# EAGLE design pms7003-adapter (EAGLE 9.6.2)
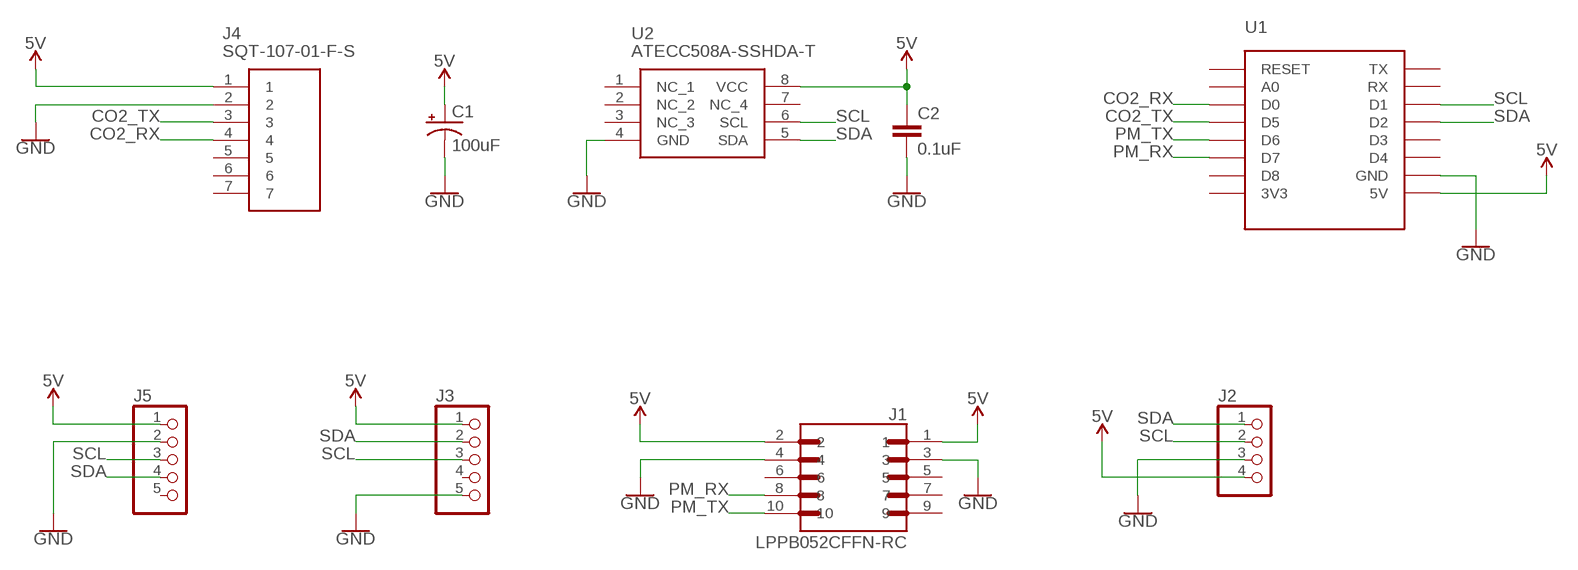
[diagram p0: schematic, sheet 1]

## Parts
C1  100uF  100UF-POLAR-RADIAL-2.5MM-25V-20%  [CPOL-RADIAL-2.5MM-6.5MM]
C2  0.1uF  0.1UF-0603-25V-(+80/-20%)  [0603]
J1  LPPB052CFFN-RC  [SULLINS_LPPB052CFFN-RC]
J2  PINHD-1X4  [1X04]
J3  PINHD-1X5  [1X05]
J4  SQT-107-01-F-S  [SQT-107-01-XX-S]
J5  PINHD-1X5  [1X05]
U1  WEMOS-D1-MINI  [WEMOS-D1-MINI]
U2  ATECC508A-SSHDA-T  [SOIC127P600X175-8N]

## Nets
5V: C1.1(+) C2.1 J1.1 J1.2 J2.4 J3.1 J4.1 J5.1 U1.5V U2.8(VCC)
CO2_RX: J4.4 U1.D0
CO2_TX: J4.3 U1.D5
GND: C1.2(-) C2.2 J1.3 J1.4 J2.3 J3.5 J4.2 J5.2 U1.GND U2.4(GND)
PM_RX: J1.8 U1.D7
PM_TX: J1.10 U1.D6
SCL: J2.2 J3.3 J5.3 U1.D1 U2.6(SCL)
SDA: J2.1 J3.2 J5.4 U1.D2 U2.5(SDA)
Unconnected: J1.5 J1.6 J1.7 J1.9 J3.4 J4.5 J4.6 J4.7 J5.5 U1.3V3 U1.A0 U1.D3 U1.D4 U1.D8 U1.RST(RESET) U1.RX U1.TX U2.1(NC_1) U2.2(NC_2) U2.3(NC_3) U2.7(NC_4)

## Library data of the parts
C1 = SparkFun-Capacitors:100UF-POLAR: 100µF polarized capacitors A capacitor is a passive two-terminal electrical component used to store electrical energy temporarily in an electric field.; PROD_ID: CAP-08439
C2 = SparkFun-Capacitors:0.1UF: 0.1µF ceramic capacitors A capacitor is a passive two-terminal electrical component used to store electrical energy temporarily in an electric field.; PROD_ID: CAP-00810
J1 = aqm-parts:LPPB052CFFN-RC: 10 Position Total Dual Row 1.27 mm Pitch Straight Female Header; DESCRIPTION: 10 Position Header Connector Through Hole; DIGI-KEY_PART_NUMBER: S9009E-05-ND; DIGI-KEY_PURCHASE_URL: https://www.digikey.com/product-detail/en/sullins-connector-solutions/LPPB052CFFN-RC/S9009E-05-ND/1786376?utm_source=snapeda&utm_medium=aggregator&utm_campaign=symbol; MF: Sullins; MP: LPPB052CFFN-RC; PACKAGE: None
J2 = pinhead:PINHD-1X4: PIN HEADER
J3 J5 = pinhead:PINHD-1X5: PIN HEADER
J4 = aqm-parts:SQT-107-01-F-S: 7 Position,Cost Effective Rugged PCB Sockets, 2.00mm pitch Source: Datasheet <http://suddendocs.samtec.com/prints/sqt-1xx-xx-xxx-x-xxx-xxx-mkt.pdf>; DESCRIPTION: 7 Position,Cost Effective Rugged PCB Sockets, 2.00mm pitch; HEIGHT: 6.35mm; MANUFACTURER_NAME: SAMTEC; MANUFACTURER_PART_NUMBER: SQT-107-01-F-S; MOUSER_PART_NUMBER: 200-SQT10701FS; MOUSER_PRICE-STOCK: https://www.mouser.co.uk/ProductDetail/Samtec/SQT-107-01-F-S?qs=rU5fayqh%252BE1jj%2FtMUPHkTQ%3D%3D
U1 = aqm-parts:WEMOS-D1-MINI: WeMos.cc D1 mini ESP8266 module
U2 = aqm-parts:ATECC508A-SSHDA-T: CryptoAuthentication 256-Bit I2C SOIC8 Source: Datasheet <http://ww1.microchip.com/downloads/en/DeviceDoc/20005927A.pdf>; DESCRIPTION: CryptoAuthentication 256-Bit I2C SOIC8; HEIGHT: 1.75mm; MANUFACTURER_NAME: Microchip; MANUFACTURER_PART_NUMBER: ATECC508A-SSHDA-T; MOUSER_PART_NUMBER: 556-ATECC508A-SSHDAT; MOUSER_PRICE-STOCK: https://www.mouser.co.uk/ProductDetail/Microchip-Technology-Atmel/ATECC508A-SSHDA-T?qs=1PHB%252BsnDjhEnuZYzFphTcQ%3D%3D

## Board
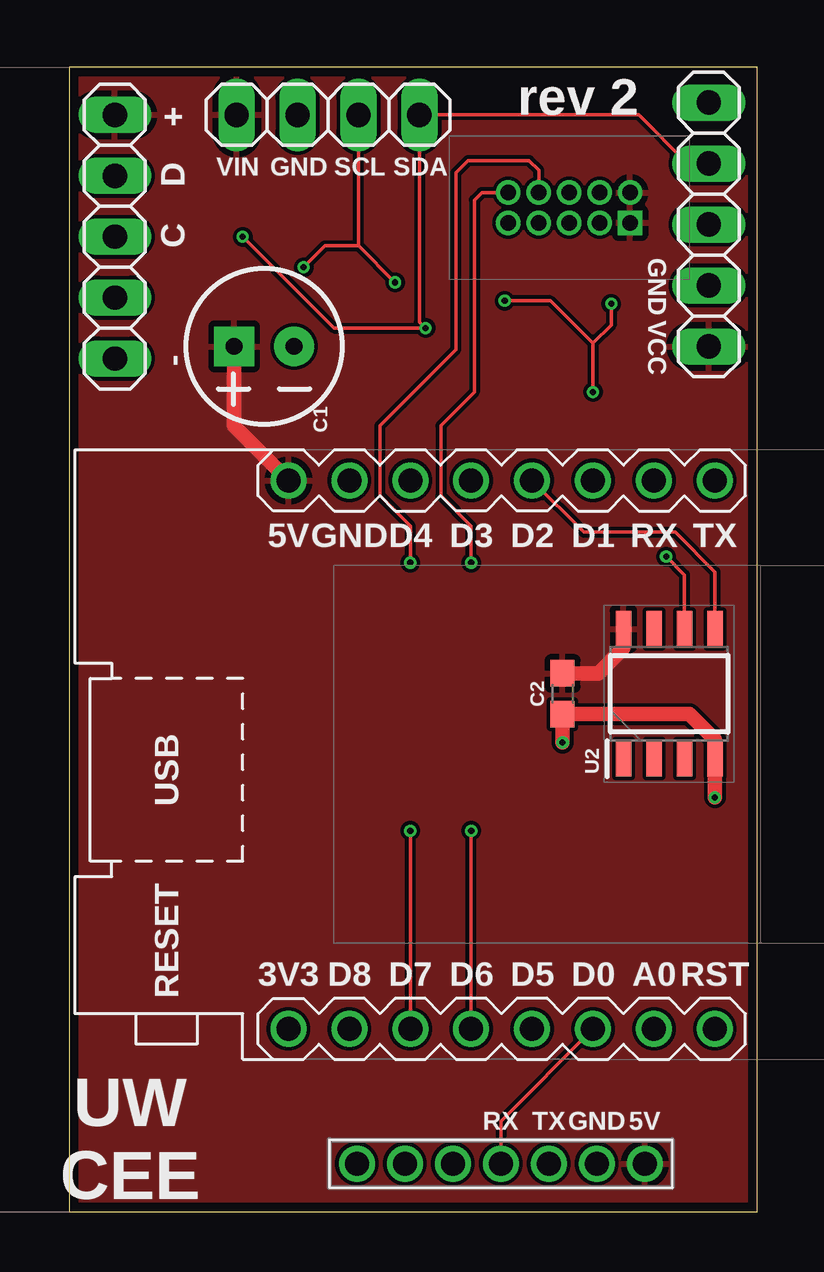
[diagram p1: board, top side]
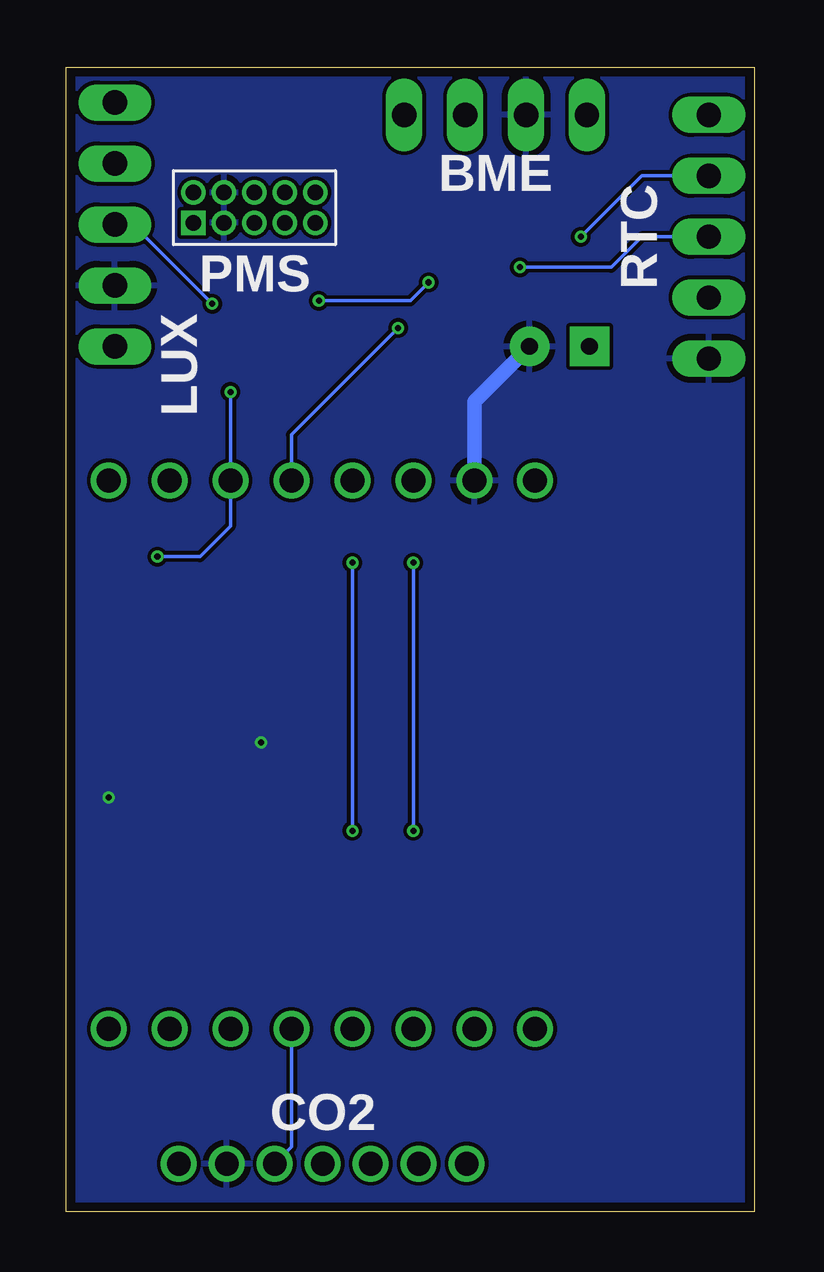
[diagram p2: board, bottom side, seen from below]

Size 28.7 x 47.7 mm. Coordinates in mm from the lower left corner, seen from the top.
Outline: 0,0 28.7,0 28.7,47.7 0,47.7 0,0
Copper layers (1*16): Top 0.035559375mm / dielectric 1.6mm / Bottom 0.035559375mm
Design rules "oshpark-2layer": minimum track width 6mil, minimum drill 10mil, track to track 6mil, track to pad 6mil, pad to pad 6mil, via to via 6mil, smd to smd 6mil, copper to edge 15mil, drill to drill 6mil, minimum pad ring 5mil, minimum via ring 5mil, stop-mask expansion 2.5mil, vias tented up to drill 0mil, thermal gap 10mil

### Footprints (pad centres in the part's own frame; a part is rotated, then mirrored left to right if it is on the bottom)
CPOL-RADIAL-2.5MM-6.5MM = drill 0.7 pad 1.651 square: 1 1.25,0 | drill 0.7 pad 1.651: 2 -1.25,0
0603 = smd 1.1 x 1: 1 -0.85,0; 2 0.85,0
SULLINS_LPPB052CFFN-RC = drill 0.65 pad 1.016 square: 1 -2.54,-0.635 | drill 0.65 pad 1.016: 2 -2.54,0.635; 3 -1.27,-0.635; 4 -1.27,0.635; 5 0,-0.635; 6 0,0.635; 7 1.27,-0.635; 8 1.27,0.635; 9 2.54,-0.635; 10 2.54,0.635
1X04 = drill 1.016 long: 1 -3.81,0; 2 -1.27,0; 3 1.27,0; 4 3.81,0
1X05 = drill 1.016 long: 1 -5.08,0; 2 -2.54,0; 3 0,0; 4 2.54,0; 5 5.08,0
SQT-107-01-XX-S = drill 0.99 pad 1.5: 1 0,0; 2 2,0; 3 4,0; 4 6,0; 5 8,0; 6 10,0; 7 12,0
WEMOS-D1-MINI = drill 1: 3V3 11.43,-8.255; 5V -11.43,-8.255; A0 11.43,6.985; D0 11.43,4.445; D1 -11.43,4.445; D2 -11.43,1.905; D3 -11.43,-0.635; D4 -11.43,-3.175; D5 11.43,1.905; D6 11.43,-0.635; D7 11.43,-3.175; D8 11.43,-5.715; GND -11.43,-5.715; RST 11.43,9.525; RX -11.43,6.985; TX -11.43,9.525
SOIC127P600X175-8N = smd 1.5 x 0.65: 1 -2.7,1.905; 2 -2.7,0.635; 3 -2.7,-0.635; 4 -2.7,-1.905; 5 2.7,-1.905; 6 2.7,-0.635; 7 2.7,0.635; 8 2.7,1.905

### Placement (x,y rotation side)
C1  8.13,36.07 180 top
C2  20.57,21.59 270 top
J1  20.85,41.85 0 bottom
J2  10.79,45.72 180 top
J3  1.91,40.64 270 top
J4  24,2 180 top
J5  26.67,41.15 90 top
U1  17.4,19.05 270 top
U2  25.02,21.59 90 top

### Tracks (layer width: path | path; a pad name or v marks a point on that pad's centre or on a via)
5V
  Top 0.61: U2.8 23.11,23.5 22.06,22.44 C2.1 | U1.5V 6.88,32.75 C1.1
  pour Top (isolate 0): 0,47.7 28.7,47.7 28.7,0 0,0
CO2_RX
  Top 0.152: U1.D0 18,3.77 J4.4
CO2_TX
  Bottom 0.152: U1.D5 19.3,2.69 J4.3
GND  (via drill 0.25)
  Top 0.61: v26.92,17.27 U2.4 26.92,19.68 25.87,20.74 C2.2 v20.57,19.56
  Bottom 0.61: C1.2 11.68,33.76 U1.GND
  pour Bottom (isolate 0): 0,47.7 28.7,47.7 28.7,0 0,0
PM_RX  (via drill 0.25)
  Top 0.152: J1.8 19.58,43.41 19.18,43.81 16.64,43.81 16.13,43.31 16.13,35.94 12.95,32.77 12.95,29.84 14.22,28.57 v14.22,27.05 | U1.D7 v14.22,15.88
  Bottom 0.152: v14.22,15.88 v14.22,27.05
PM_TX  (via drill 0.25)
  Top 0.152: J1.10 17.21,42.48 16.89,42.16 16.89,34.16 15.49,32.77 15.49,29.84 16.76,28.57 v16.76,27.05 | U1.D6 v16.76,15.88
  Bottom 0.152: v16.76,15.88 v16.76,27.05
SCL  (via drill 0.25)
  Top 0.152: v18.16,37.97 20.07,37.97 21.84,36.2 | v13.59,38.73 12.06,40.26 | 12.06,40.26 J2.2 | v9.78,39.37 10.67,40.26 12.06,40.26 | v24.89,27.3 25.65,26.54 U2.6 | v22.61,37.85 22.61,36.96 21.84,36.2 | 21.84,36.2 v21.84,34.16
  Bottom 0.152: v18.16,37.97 14.35,37.97 v13.59,38.73 | J3.3 4.7,40.64 5.97,39.37 v9.78,39.37 | v24.89,27.3 23.11,27.3 21.84,28.57 U1.D1 v21.84,34.16 | J5.3 25.91,41.15 v22.61,37.85
SDA  (via drill 0.25)
  Top 0.152: v7.24,40.64 11.05,36.83 v14.86,36.83 14.61,37.08 J2.1 23.75,45.72 25.78,43.69 J5.4 | U1.D2 21.46,28.32 25.27,28.32 26.92,26.67 U2.5
  Bottom 0.152: J3.2 4.7,43.18 v7.24,40.64 | v14.86,36.83 19.3,32.38 U1.D2

### Text on the board
tPlace: rev 2 | UW / CEE
bPlace: BME | RTC | PMS | LUX | CO2
tNames: + | VIN | GND | SCL | SDA | D | C | GND | VCC | - | RX | TX | GND | 5V